# Altium project FTDI-Toolkit-Rev.1.0.PrjPcb
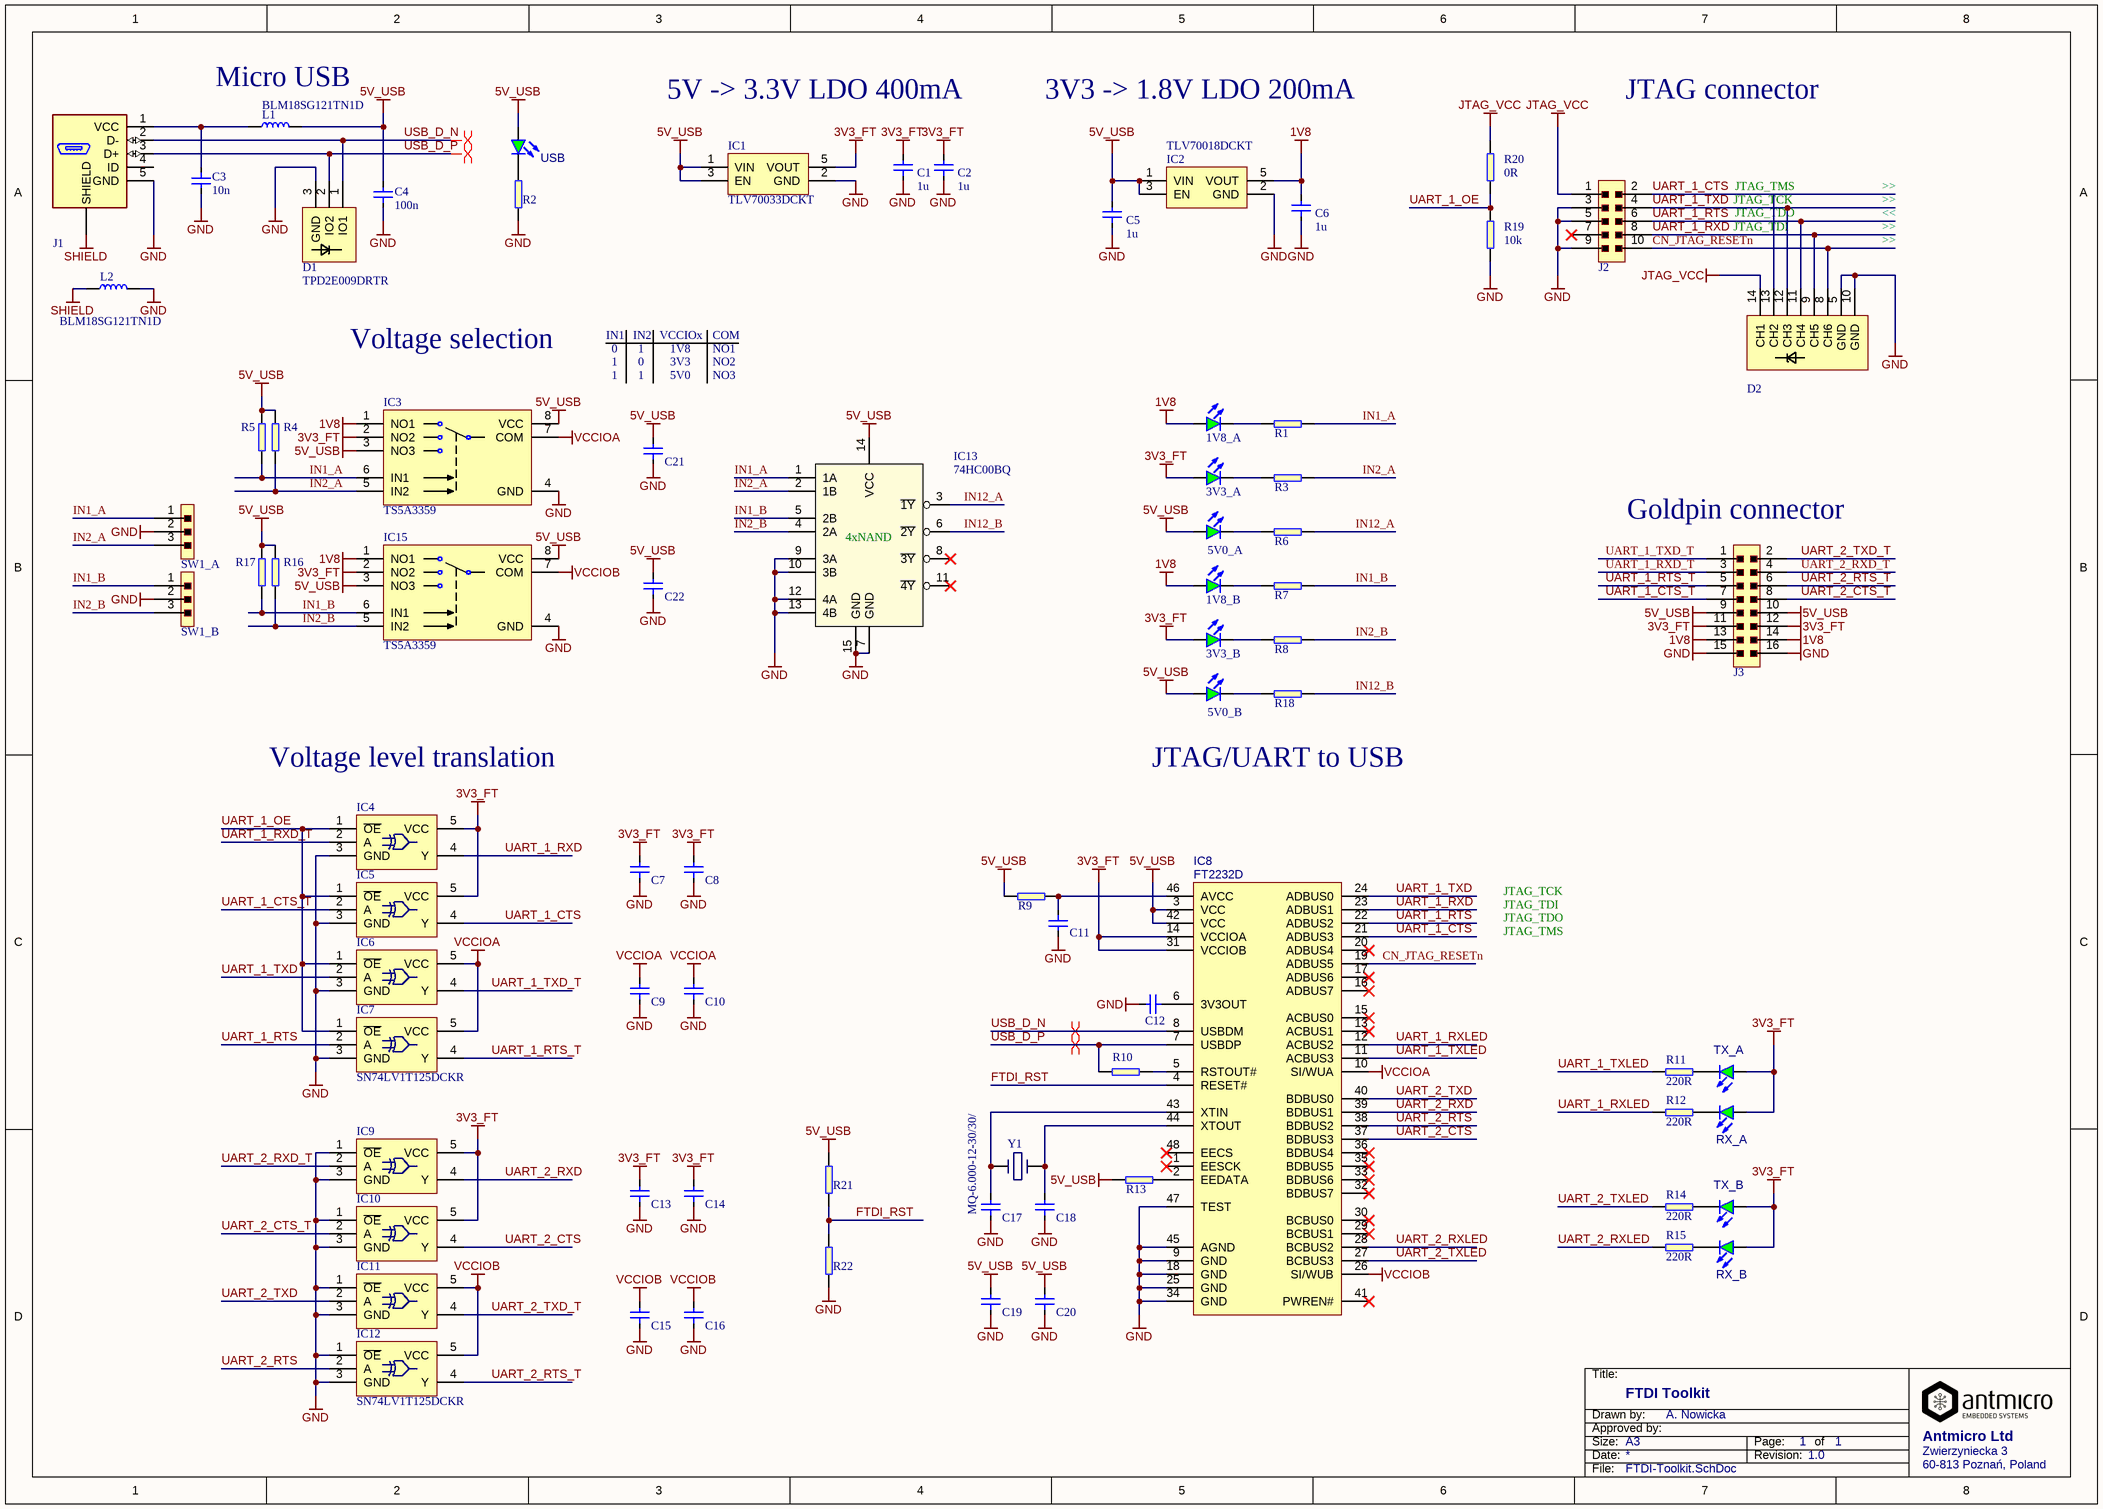
[diagram p0: FTDI-Toolkit.SchDoc]
AM_Title: FTDI Toolkit; AM_Revision: 1.0; AM_Author: A. Nowicka
1 sheet, 79 parts. Net scope: global (net labels, ports and power ports of the same name join across sheets).
Board file: PCB.PcbDoc

## Sheet FTDI-Toolkit.SchDoc: Project name
size A3; Revision: 0.0; SheetNumber: 1; SheetTotal: 1; PageSetup: Record=PageOptions|CenterHorizontal=True|CenterVertical=True|PrintScale=0.97|XCorrection=1.00|YCorrection=1.00|PrintKind=1|BorderSize=5000000|LeftOffset=0|BottomOffset=0|Orientation=2|PaperLength=2970|PaperWidth=2100|Scale=100|PaperSource=7|PrintQuality=600|MediaType=1|DitherType=10|PaperKind=A4|PrintScaleMode=1

### Parts
1V8_A  KPT-1608SGC  [LED0603]  (value not drawn)
1V8_B  KPT-1608SGC  [LED0603]  (value not drawn)
3V3_A  KPT-1608SGC  [LED0603]  (value not drawn)
3V3_B  KPT-1608SGC  [LED0603]  (value not drawn)
5V0_A  KPT-1608SGC  [LED0603]  (value not drawn)
5V0_B  KPT-1608SGC  [LED0603]  (value not drawn)
C1  1u  [0603]
C2  1u  [0603]
C3  10n  [0402]
C4  100n  [0402]
C5  1u  [0603]
C6  1u  [0603]
C7  100n  [0402]  (value not drawn)
C8  100n  [0402]  (value not drawn)
C9  100n  [0402]  (value not drawn)
C10  100n  [0402]  (value not drawn)
C11  100n  [0402]  (value not drawn)
C12  100n  [0402]  (value not drawn)
C13  100n  [0402]  (value not drawn)
C14  100n  [0402]  (value not drawn)
C15  100n  [0402]  (value not drawn)
C16  100n  [0402]  (value not drawn)
C17  27p  [0402]  (value not drawn)
C18  27p  [0402]  (value not drawn)
C19  100n  [0402]  (value not drawn)
C20  100n  [0402]  (value not drawn)
C21  100n  [0603]  (value not drawn)
C22  100n  [0603]  (value not drawn)
D1  TPD2E009DRTR  [SOT-3]
D2  TPD6E05U06  [TPD6E05U06_PASS]  (value not drawn)
IC1  TLV70033DCKT  [SC70-5]
IC2  TLV70018DCKT  [SC70-5]
IC3  TS5A3359  [TS5A3359]
IC4  SN74LV1T125DCKR  [SC70-5]  (value not drawn)
IC5  SN74LV1T125DCKR  [SC70-5]  (value not drawn)
IC6  SN74LV1T125DCKR  [SC70-5]  (value not drawn)
IC7  SN74LV1T125DCKR  [SC70-5]
IC8  FT2232D  [LQFP-48]
IC9  SN74LV1T125DCKR  [SC70-5]  (value not drawn)
IC10  SN74LV1T125DCKR  [SC70-5]  (value not drawn)
IC11  SN74LV1T125DCKR  [SC70-5]  (value not drawn)
IC12  SN74LV1T125DCKR  [SC70-5]
IC13  74HC00BQ  [DHVQFN14]
IC15  TS5A3359  [TS5A3359]
J1  (no value)  [WE_629105150521]
J2  SHF-105-01-L-D-SM  [SHF-105-01-X-D-SM]  (value not drawn)
J3  MH_2X08_2.00_RA  [MH_2X08_2.00_RA]  (value not drawn)
L1  BLM18SG121TN1D  [0603]
L2  BLM18SG121TN1D  [0603]
R1  220R  [0402]  (value not drawn)
R2  470R  [0402]  (value not drawn)
R3  220R  [0402]  (value not drawn)
R4  10k  [0402]  (value not drawn)
R5  10k  [0402]  (value not drawn)
R6  220R  [0402]  (value not drawn)
R7  220R  [0402]  (value not drawn)
R8  220R  [0402]  (value not drawn)
R9  470R  [0402]  (value not drawn)
R10  1k54  [0402]  (value not drawn)
R11  220R  [0402]
R12  220R  [0402]
R13  10k  [0402]  (value not drawn)
R14  220R  [0402]
R15  220R  [0402]
R16  10k  [0402]  (value not drawn)
R17  10k  [0402]  (value not drawn)
R18  220R  [0402]  (value not drawn)
R19  10k  [0402]
R20  0R  [0402]
R21  4k7  [0402]  (value not drawn)
R22  10k  [0402]  (value not drawn)
RX_A  KPT-1608SGC  [LED0603]  (value not drawn)
RX_B  KPT-1608SGC  [LED0603]  (value not drawn)
SW1_A  MH_1X03_2.54  [MH_1X03_2.54]  (value not drawn)
SW1_B  MH_1X03_2.54  [MH_1X03_2.54]  (value not drawn)
TX_A  KPT-1608SGC  [LED0603]  (value not drawn)
TX_B  KPT-1608SGC  [LED0603]  (value not drawn)
USB  KPT-1608SGC  [LED0603]  (value not drawn)
Y1  MQ-6.000-12-30/30/  [Crystal_5x7mm]

### Nets
1V8: 1V8_A.A 1V8_B.A C6.2 IC2.5(VOUT) IC3.1(NO1) IC15.1(NO1) J3.13 J3.14
3V3_FT: 3V3_A.A 3V3_B.A C1.2 C2.2 C7.2 C8.2 C13.2 C14.2 IC1.5(VOUT) IC3.2(NO2) IC4.5(VCC) IC5.5(VCC) IC8.14(VCCIOA) IC8.31(VCCIOB) IC9.5(VCC) IC10.5(VCC) IC15.2(NO2) J3.11 J3.12 RX_A.A RX_B.A TX_A.A TX_B.A
5V_USB: 5V0_A.A 5V0_B.A C4.2 C5.2 C19.2 C20.2 C21.2 C22.2 IC1.1(VIN) IC1.3(EN) IC2.1(VIN) IC2.3(EN) IC3.3(NO3) IC3.8(VCC) IC8.3(VCC) IC8.42(VCC) IC13.14(VCC) IC15.3(NO3) IC15.8(VCC) J3.9 J3.10 L1.1 R4.2 R5.2 R9.1 R13.1 R16.2 R17.2 R21.2 USB.A
GND: C1.1 C2.1 C3.2 C4.1 C5.1 C6.1 C7.1 C8.1 C9.1 C10.1 C11.2 C12.2 C13.1 C14.1 C15.1 C16.1 C17.1 C18.1 C19.1 C20.1 C21.1 C22.1 D1.3(GND) D2.5(GND) D2.10(GND) IC1.2(GND) IC2.2(GND) IC3.4(GND) IC4.3(GND) IC5.3(GND) IC6.3(GND) IC7.3(GND) IC8.9(GND) IC8.18(GND) IC8.25(GND) IC8.34(GND) IC8.45(AGND) IC8.47(TEST) IC9.1(~{OE}) IC9.3(GND) IC10.1(~{OE}) IC10.3(GND) IC11.1(~{OE}) IC11.3(GND) IC12.1(~{OE}) IC12.3(GND) IC13.7(GND) IC13.9(3A) IC13.10(3B) IC13.12(4A) IC13.13(4B) IC13.15(GND) IC15.4(GND) J1.5(GND) J2.3 J2.5 J2.9 J3.15 J3.16 L2.1 R2.1 R19.1 R22.1 SW1_A.2 SW1_B.2
JTAG_VCC: D2.14(CH1) J2.1 R20.2
SHIELD: J1.S(SHIELD) L2.2
VCCIOA: C9.2 C10.2 IC3.7(COM) IC6.5(VCC) IC7.5(VCC) IC8.10(SI/WUA)
VCCIOB: C15.2 C16.2 IC8.26(SI/WUB) IC11.5(VCC) IC12.5(VCC) IC15.7(COM)
CN_JTAG_RESETn: D2.8(CH6) IC8.19(ADBUS5) J2.10
FTDI_RST: IC8.4(RESET#) R21.1 R22.2
IN1_A: IC3.6(IN1) IC13.1(1A) R1.2 R5.1 SW1_A.1
IN1_B: IC13.5(2B) IC15.6(IN1) R7.2 R17.1 SW1_B.1
IN2_A: IC3.5(IN2) IC13.2(1B) R3.2 R4.1 SW1_A.3
IN2_B: IC13.4(2A) IC15.5(IN2) R8.2 R16.1 SW1_B.3
IN12_A: IC13.3(~{1Y}) R6.2
IN12_B: IC13.6(~{2Y}) R18.2
UART_1_CTS: D2.13(CH2) IC5.4(Y) IC8.21(ADBUS3) J2.2
UART_1_CTS_T: IC5.2(A) J3.7
UART_1_OE: IC4.1(~{OE}) IC5.1(~{OE}) IC6.1(~{OE}) IC7.1(~{OE}) R19.2 R20.1
UART_1_RTS: D2.11(CH4) IC7.2(A) IC8.22(ADBUS2) J2.6
UART_1_RTS_T: IC7.4(Y) J3.5
UART_1_RXD: D2.9(CH5) IC4.4(Y) IC8.23(ADBUS1) J2.8
UART_1_RXD_T: IC4.2(A) J3.3
UART_1_RXLED: IC8.12(ACBUS2) R12.1
UART_1_TXD: D2.12(CH3) IC6.2(A) IC8.24(ADBUS0) J2.4
UART_1_TXD_T: IC6.4(Y) J3.1
UART_1_TXLED: IC8.11(ACBUS3) R11.1
UART_2_CTS: IC8.37(BDBUS3) IC10.4(Y)
UART_2_CTS_T: IC10.2(A) J3.8
UART_2_RTS: IC8.38(BDBUS2) IC12.2(A)
UART_2_RTS_T: IC12.4(Y) J3.6
UART_2_RXD: IC8.39(BDBUS1) IC9.4(Y)
UART_2_RXD_T: IC9.2(A) J3.4
UART_2_RXLED: IC8.28(BCBUS2) R15.1
UART_2_TXD: IC8.40(BDBUS0) IC11.2(A)
UART_2_TXD_T: IC11.4(Y) J3.2
UART_2_TXLED: IC8.27(BCBUS3) R14.1
USB_D_N: D1.1(IO1) IC8.8(USBDM) J1.2(D-)
USB_D_P: D1.2(IO2) IC8.7(USBDP) J1.3(D+) R10.1
Net1V8_A_K: 1V8_A.K R1.1
Net1V8_B_K: 1V8_B.K R7.1
Net3V3_A_K: 3V3_A.K R3.1
Net3V3_B_K: 3V3_B.K R8.1
Net5V0_A_K: 5V0_A.K R6.1
Net5V0_B_K: 5V0_B.K R18.1
NetC3_1: C3.1 J1.1(VCC) L1.2
NetC11_1: C11.1 IC8.46(AVCC) R9.2
NetC12_1: C12.1 IC8.6(3V3OUT)
NetC17_2: C17.2 IC8.43(XTIN) Y1.1
NetC18_2: C18.2 IC8.44(XTOUT) Y1.2
NetIC8_2: IC8.2(EEDATA) R13.2
NetIC8_5: IC8.5(RSTOUT#) R10.2
NetR2_2: R2.2 USB.K
NetR11_2: R11.2 TX_A.K
NetR12_2: R12.2 RX_A.K
NetR14_2: R14.2 TX_B.K
NetR15_2: R15.2 RX_B.K

Not connected (* = marked no-connect by the designer): IC8 1(EESCK)* 13(ACBUS1)* 15(ACBUS0)* 16(ADBUS7)* 17(ADBUS6)* 20(ADBUS4)* 29(BCBUS1)* 30(BCBUS0)* 32(BDBUS7)* 33(BDBUS6)* 35(BDBUS5)* 36(BDBUS4)* 41(PWREN#)* 48(EECS)*; IC13 8(~{3Y})* 11(~{4Y})*; J1 4(ID); J2 7*

### Layout directives
differential pair: USB_D_N, USB_D_P

### Notes on the sheet
- (near L1) Micro USB
- 5V -> 3.3V LDO 400mA
- 3V3 -> 1.8V LDO 200mA
- JTAG connector
- JTAG_TCK
- JTAG_TDI
- JTAG_TDO
- JTAG_TMS
- <<
- >>
- Voltage selection
- IN1
- 1
- 0
- IN2
- VCCIOx
- 1V8
- 3V3
- 5V0
- COM
- NO2
- NO1
- NO3
- (near J3) Goldpin connector
- Voltage level translation
- JTAG/UART to USB
- Title:
- Drawn by:
- Size:
- Date:
- Approved by:
- A3
- Revision:
- Page:
- of
- Antmicro Ltd
- Zwierzyniecka 3
- File:
- 60-813 Poznań, Poland
- (in symbol 74HC00BQ) 4xNAND

### Library data of the parts
1V8_A 1V8_B 3V3_A 3V3_B 5V0_A 5V0_B = LED_G: LED Green 0603 case; PartNumber: LED_G; Manufacturer: KINGBRIGHT; Value: KPT-1608SGC; Supplier1: Farnell; SupplierPartNumber1: 2099223
C1 C2 C5 C6 = C_1u_0603: MLCC SMT Capacitor 1uF 0603; Manufacturer: KEMET; PartNumber: C_1u_0603; Value: 1u; Supplier1: Farnell; SupplierPartNumber1: 2821145
C3 = C_10n_0402: MLCC SMT Capacitor 10nF 0402; Manufacturer: AVX; Part Symbol: 04025G103ZAT2A; Value: 10n; Part Number: C_10n_0402; Supplier 1: Farnell; Supplier Part Number 1: 2332531
C4 = C_100n_0402: MLCC SMT Capacitor 100nF 0402; Manufacturer: MULTICOMP; Part Symbol: MC0402X104M100CT; Value: 100n; Part Number: C_100n_0402; Supplier 1: Farnell; Supplier Part Number 1: 2309011
C7-C16 C19 C20 = C_100n_0402: MLCC SMT Capacitor 100nF 0402; Manufacturer: TDK; PartNumber: C_100n_0402; Value: 100n; Supplier1: Farnell; SupplierPartNumber1: 2525006
C17 C18 = C_27p_0402: MLCC SMT Capacitor 27pF 0402; Manufacturer: WALSIN; PartNumber: C_27p_0402; Value: 27p; Supplier1: Farnell; SupplierPartNumber1: 2496801
C21 C22 = C_100n_0603: MLCC SMT Capacitor 100nF 0603; Manufacturer: AVX; PartNumber: C_100n_0603; Value: 100n; Supplier1: Farnell; SupplierPartNumber1: 2496834
D1 = TPD2E009DRTR: ESD Suppressors 2-CH; Manufacturer: Texas Instruments; Part Number: TPD2E009DRTR; Value: TPD2E009DRTR; Supplier 1: Digi-Key; Supplier Part Number 1: 296-25410-1-ND; Supplier 2: Farnell; Supplier Part Number 2: 2459951; Part Symbol: TPD2E009DRTR
D2 = TPD6E05U06_PASS: ESD Suppressors 6-CH Pass through layout; Manufacturer: Texas Instruments; PartNumber: TPD6E05U06_PASS; Value: TPD6E05U06; Supplier1: Digi-Key; SupplierPartNumber1: 296-39349-1-ND
IC1 = TLV70033DCKT: Voltage Regulator, 2V to 5.5V, 175mV Dropout, 3.3Vout, 200mAout; Manufacturer: TEXAS INSTRUMENTS; PartNumber: TLV70033DCKT; Value: TLV70033DCKT; Supplier1: Farnell; SupplierPartNumber1: 1815750
IC2 = TLV70018DCKT: Voltage Regulator, 2V to 5.5V, 175mV Dropout, 1.8Vout, 200mAout; Manufacturer: TEXAS INSTRUMENTS; PartNumber: TLV70018DCKT; Value: TLV70018DCKT; Supplier1: Farnell; SupplierPartNumber1: 1778221
IC3 IC15 = TS5A3359: Analogue Switch, SP3T, 1 Channels, 0.9 ohm, 1.65V to 5.5V, VSSOP, 8 Pins; Manufacturer: Texas Instruments; PartNumber: TS5A3359; Value: TS5A3359; Supplier1: Farnell; SupplierPartNumber1: 1755411
IC4-IC7 IC9-IC12 = SN74LV1T125DCKR: Buffer, 74LV1T125, 1.6 V to 5.5 V, SOT-23-5; Manufacturer: Texas Instruments; PartNumber: SN74LV1T125DCKR; Value: SN74LV1T125DCKR; Supplier1: Farnell; SupplierPartNumber1: 2499910
IC8 = FT2232D: Dual USB-UART/FIFO; Part Number: FT2232D; Value: FT2232D; Supplier 1: Farnell; Supplier Part Number 1: 1615843
IC13 = 74HC00BQ: 2 NAND Gate, 4 channel; Manufacturer: NEXPERIA; PartNumber: 74HC00BQ; Value: 74HC00BQ; Supplier1: Digi-Key; SupplierPartNumber1: 1727-3213-1-ND
J1 = WE_629105150521: Micro USB B; Manufacturer: WURTH ELEKTRONIK; Part Number: WE_629105150521; Supplier Part Number 1: 2470822; Supplier 1: Farnell; Part Symbol: 629105150521
J2 = SHF-105-01-L-D-SM: 10 Positions Header Connector 0.050" (1.27mm) Surface Mount Gold; Manufacturer: Samtec; Pins number: 20; Part Number: SHF-105-01-L-D-SM; Supplier Part Number 1: 1885915; Value: SHF-105-01-L-D-SM; Supplier 1: Farnell; Part Symbol: SHF-105-01-L-D-SM
J3 = MH_2X08_2.00_RA: Male header, 2 x 08 pins, pitch 2.00 mm, right angle; PartNumber: MH_2X08_2.00_RA; Value: MH_2X08_2.00_RA
L1 L2 = BLM18SG121TN1D: FERRITE BEAD, 0.025OHM, 3A, 0603; Manufacturer: MURATA; Part Number: BLM18SG121TN1D; Value: BLM18SG121TN1D; Supplier 1: Farnell; Supplier Part Number 1: 1515752; Rated Current: 3A; Part Symbol: BLM18SG121TN1D
R1 R3 R6-R8 R11 R12 R14 R15 R18 = R_220R_0402: SMT Resistor 220R 0402; Manufacturer: TE CONNECTIVITY / NEOHM; PartNumber: R_220R_0402; Value: 220R; Supplier1: Farnell; SupplierPartNumber1: 1174148
R2 R9 = R_470R_0402: SMT Resistor 470R 0402; Manufacturer: VISHAY; Value: 470R; PartNumber: R_470R_0402; Supplier1: Farnell; SupplierPartNumber1: 2140742
R4 R5 R13 R16 R17 R19 R22 = R_10k_0402: SMT Resistor 0402; Manufacturer: VISHAY; Tolerance: 1%; PartNumber: R_10k_0402; Value: 10k; Supplier1: Farnell; SupplierPartNumber1: 1738864
R10 = R_1k54_0402: SMT Resistor 1k54 0402; Manufacturer: VISHAY; Tolerance: 1%; PartNumber: R_1k54_0402; Value: 1k54; Supplier1: Farnell; SupplierPartNumber1: 2140790
R20 = R_0R_0402: SMT Resistor 0402; Manufacturer: PANASONIC; PartNumber: R_0R_0402; Value: 0R; Supplier1: Farnell; SupplierPartNumber1: 2059190
R21 = R_4k7_0402: SMT Resistor 4k7 0402; Manufacturer: PANASONIC ELECTRONIC COMPONENTS; PartNumber: R_4k7_0402; Value: 4k7; Supplier1: Farnell; SupplierPartNumber1: 2059234
RX_A RX_B TX_A TX_B USB = LED_G: LED Green 0603 case; Part Number: LED_G; Manufacturer: KINGBRIGHT; Value: KPT-1608SGC; Supplier 1: Farnell; Supplier Part Number 1: 2099223; Part Symbol: KPT-1608SGC
SW1_A SW1_B = MH_1X03_2.54: Male header, 1 x 03 pins, pitch 2.54 mm; Manufacturer: HARWIN; PartNumber: MH_1X03_2.54; Value: MH_1X03_2.54; Supplier1: Farnell; SupplierPartNumber1: 1022248
Y1 = CRYSTAL_6_MHz_SMD: CRYSTAL, 6MHZ, 12PF, SMD,30ppm; Manufacturer: MERCURY UNITED ELECTRONICS; Value: MQ-6.000-12-30/30/; PartNumber: CRYSTAL_6_MHz_SMD; Supplier1: Farnell; SupplierPartNumber1: 2509174

## Assembly variants
Prototype: all parts fitted